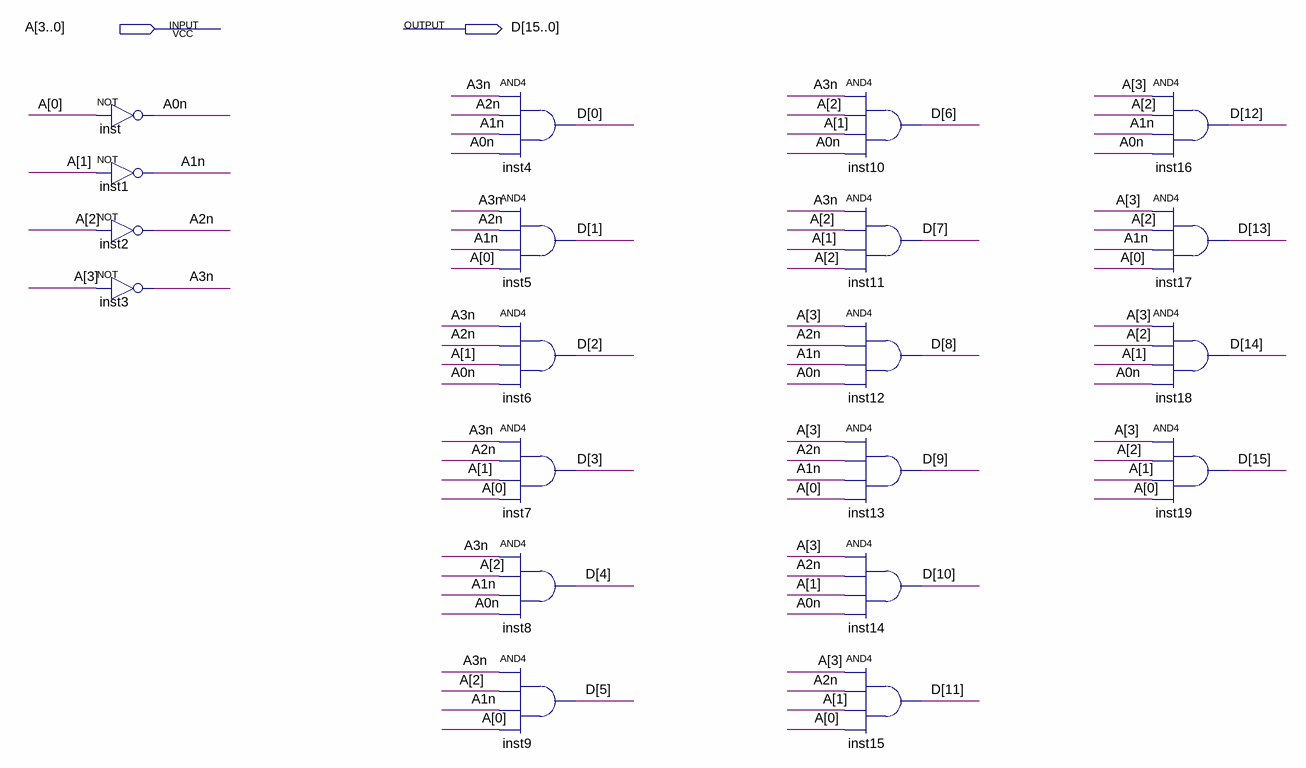
[diagram p0: schematic sheet]
// Quartus schematic Decoder4_16.bdf as structural Verilog: 20 symbols, 2 pins
module Decoder4_16 (
  input  [3:0] A,
  output [15:0] D
);

  wire A0n, A1n, A2n, A3n;

  not inst (A0n, A[0]);
  not inst1 (A1n, A[1]);
  not inst2 (A2n, A[2]);
  not inst3 (A3n, A[3]);
  and inst4 (D[0], A3n, A2n, A1n, A0n);
  and inst5 (D[1], A3n, A2n, A1n, A[0]);
  and inst6 (D[2], A3n, A2n, A[1], A0n);
  and inst7 (D[3], A3n, A2n, A[1], A[0]);
  and inst8 (D[4], A3n, A[2], A1n, A0n);
  and inst9 (D[5], A3n, A[2], A1n, A[0]);
  and inst10 (D[6], A3n, A[2], A[1], A0n);
  and inst11 (D[7], A3n, A[2], A[1], A[2]);
  and inst12 (D[8], A[3], A2n, A1n, A0n);
  and inst13 (D[9], A[3], A2n, A1n, A[0]);
  and inst14 (D[10], A[3], A2n, A[1], A0n);
  and inst15 (D[11], A[3], A2n, A[1], A[0]);
  and inst16 (D[12], A[3], A[2], A1n, A0n);
  and inst17 (D[13], A[3], A[2], A1n, A[0]);
  and inst18 (D[14], A[3], A[2], A[1], A0n);
  and inst19 (D[15], A[3], A[2], A[1], A[0]);
endmodule
